# EasyEDA schematic 1-Schematic_今天的代码不Error.json
TITLE: Sheet_1; REV: 1.0; Date: 2022-07-03; Sheet: 1/1; Drawn By: Saitouhao; Company: Your Company
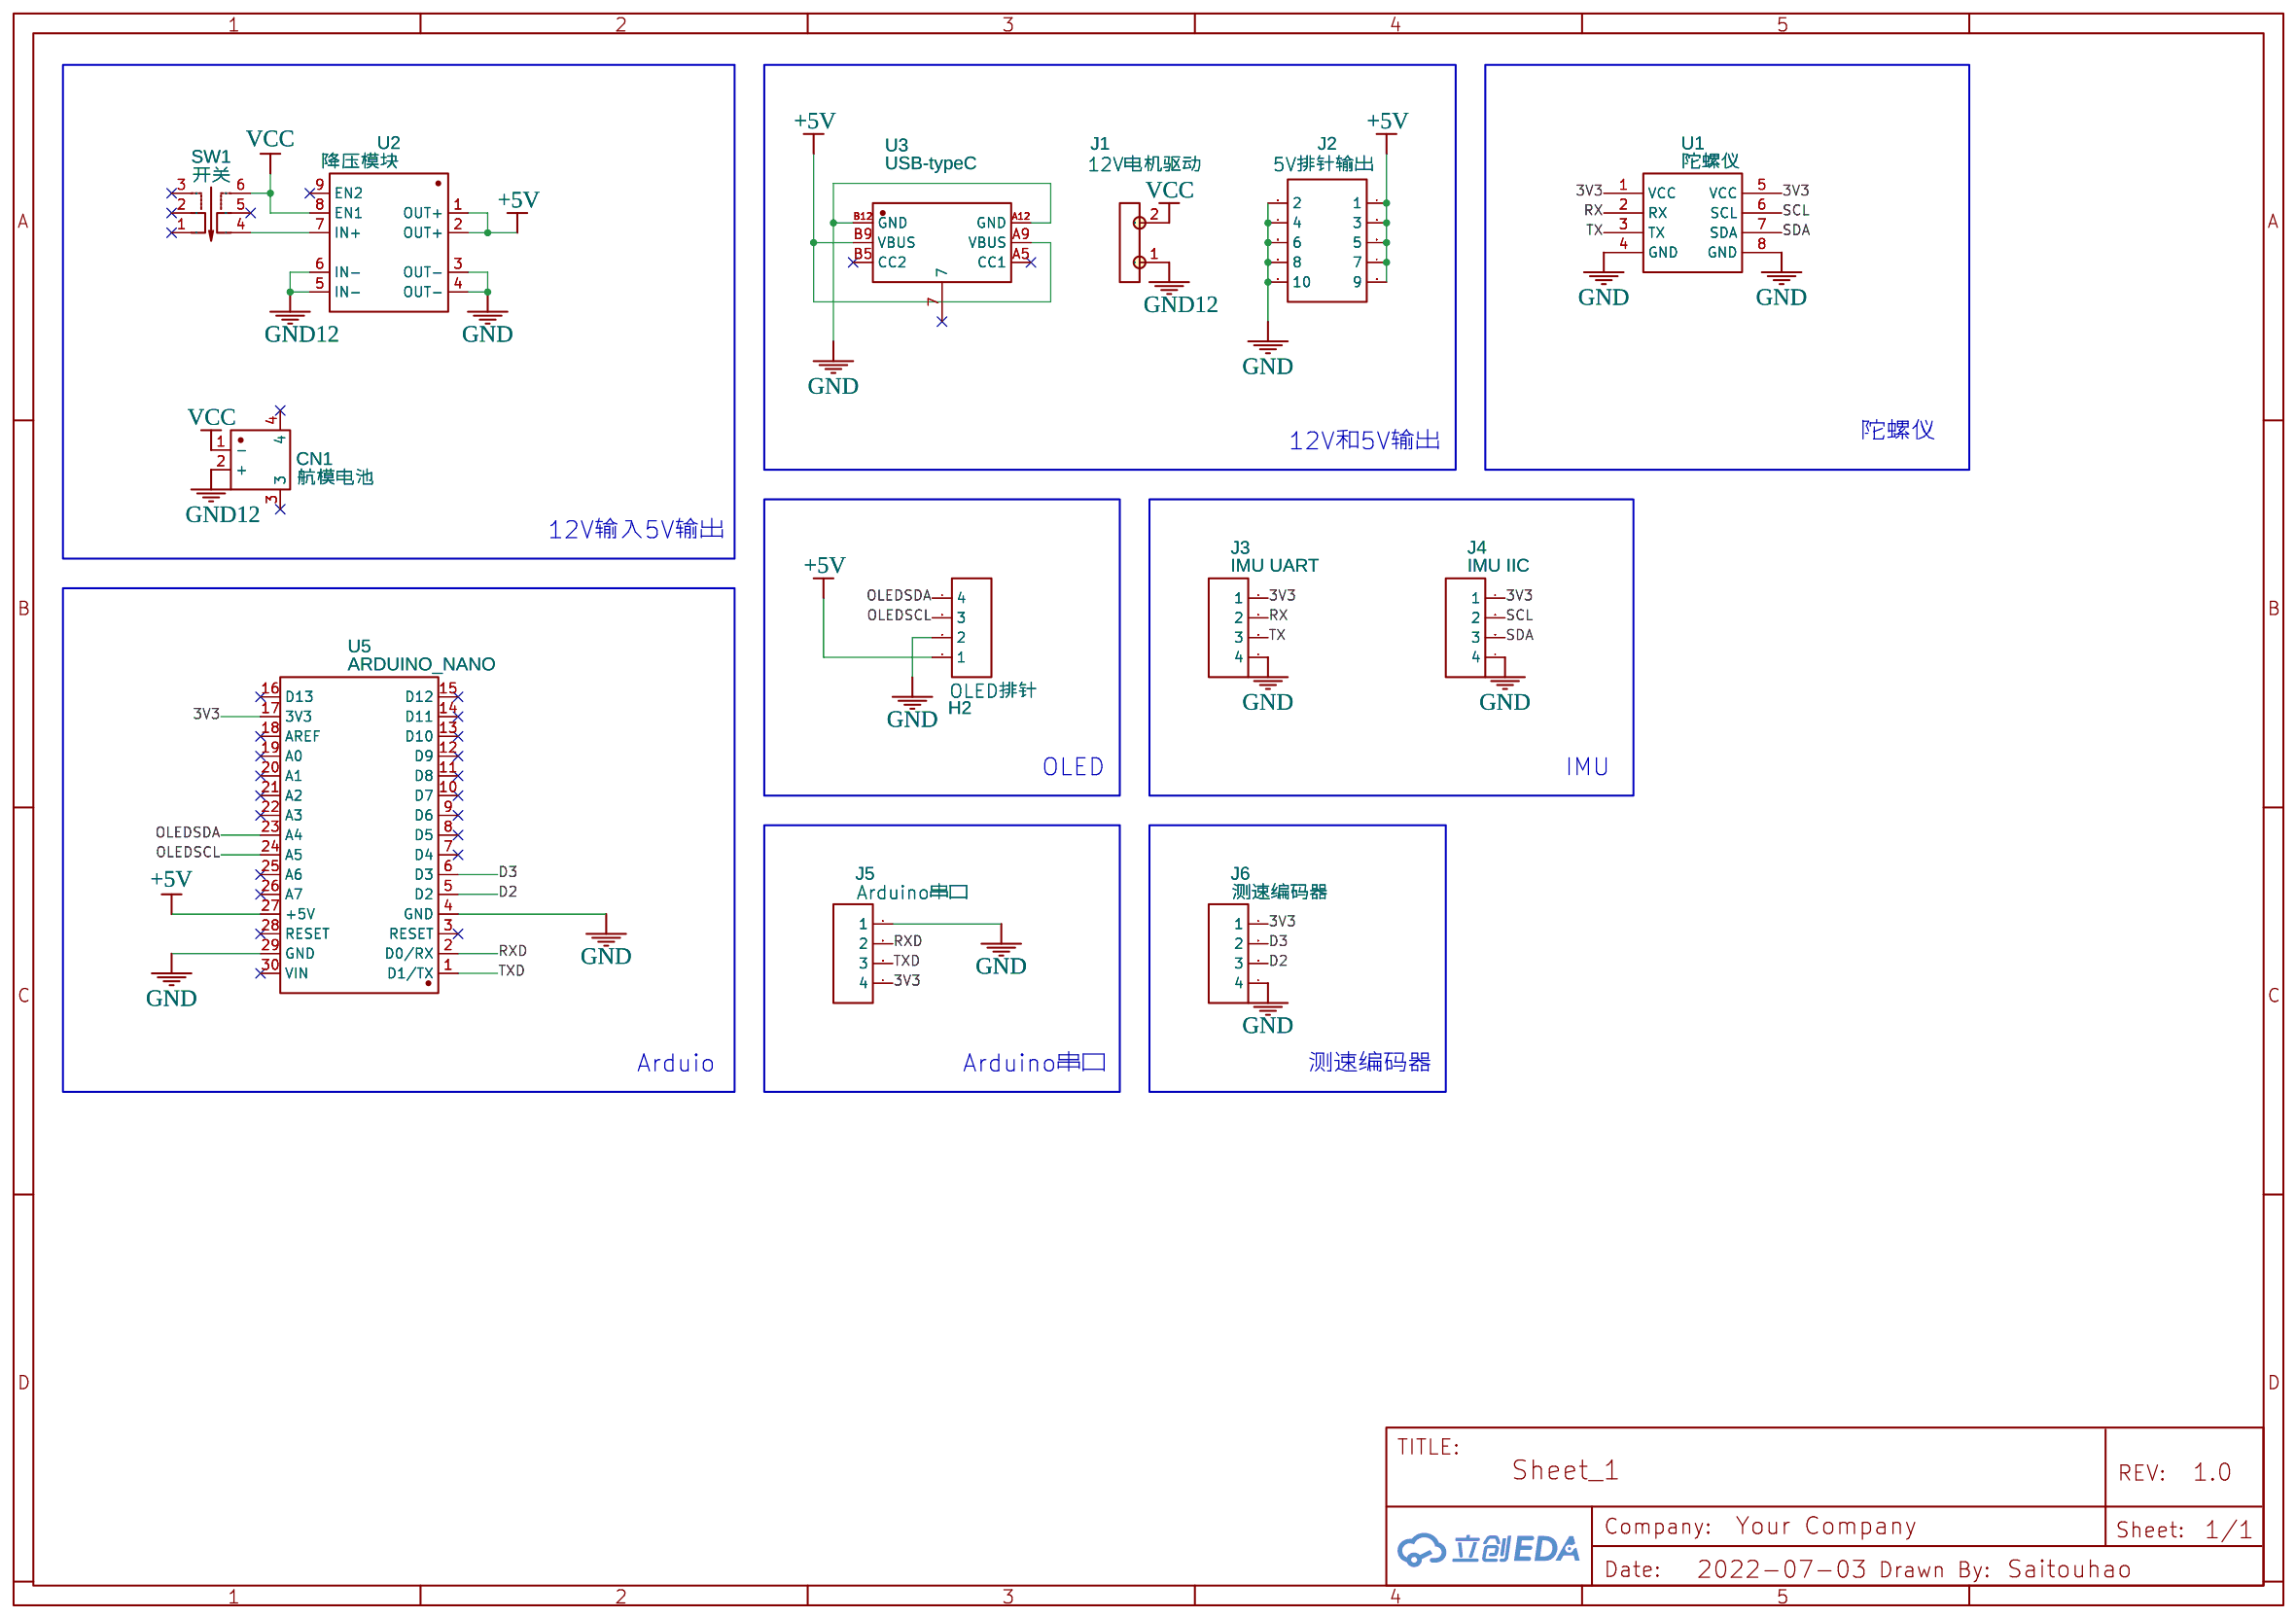
[diagram p0: schematic sheet]

## Parts
CN1  航模电池  [CONN-TH_XT60PW-M]
H2  OLED排针  [HDR-F-2.54_1X4]
J1  12V电机驱动  [CONN-TH_2P-P5.00-V-F_DB301R-5.0-2P]
J2  5V排针输出  [HDR-M-2.54_2X5]
J3  IMU UART  [HDR-M-2.54_1X4]
J4  IMU IIC  [HDR-M-2.54_1X4]
J5  Arduino串口  [HDR-M-2.54_1X4]
J6  测速编码器  [HDR-M-2.54_1X4]
SW1  开关  [SW-TH_6P-L5.8-W5.8-P2.00-LS4.5-BL]
U1  陀螺仪  [JY61-DIP8]
U2  降压模块  [XN-50L_SMD-9]
U3  USB-typeC  [TYPE-C-SMD_TYPE-C-6P-1]
U5  ARDUINO_NANO  [COMM-TH_ARDUINO_NANO]

## Library data of the parts
CN1 = XT60PW-M: Supplier: LCSC; Supplier Part: C98732; Manufacturer: AMASS(艾迈斯); JLCPCB Part Class: Extended Part; Contributor: LCSC
H2 = HDR-F-2.54_1x4: Supplier Part: C225501; Supplier: LCSC; Contributor: CUIT20190210800
J1 = CON1X02: Contributor: KiCad
J2 = HDR-M-2.54_2x5: Supplier Part: C178292; Supplier: LCSC; Contributor: chenjingxiong888
J3-J6 = HDR-M-2.54_1x4: Supplier Part: C124378; Supplier: LCSC; Contributor: 第13届蓝桥杯大赛学习团队
SW1 = PB22E60L: Supplier: LCSC; Supplier Part: C2987421; Manufacturer: CIKI(皓富); link: https://atta.szlcsc.com/upload/public/pdf/source/20220408/7804C2A84B830DBCF70465BF0AEFEFAC.pdf; Contributor: lcsc
U1 = JY61-DIP8: Contributor: wxyu999
U2 = XN-50L: Contributor: gongqianchao
U3 = USB-TYPE-C6P: Supplier: LCSC; Supplier Part: C9900001831; Manufacturer: null; JLCPCB Part Class: Extended Part; Contributor: LCSC
U5 = ARDUINO_NANO: Supplier: LCSC; Supplier Part: C9900017879; Manufacturer: null; JLCPCB Part Class: Extended Part; Contributor: lcsc

## Nets
3V3: J3.1 J4.1 J5.4 J6.1 U1.1(VCC) U1.5(VCC) U5.17(3V3)
+5V: H2.1 J2.1 J2.3 J2.5 J2.7 J2.9 U2.1(OUT+) U2.2(OUT+) U3.A9(VBUS) U3.B9(VBUS) U5.27(+5V)
GND: H2.2 J2.2 J2.4 J2.6 J2.8 J2.10 J3.4 J4.4 J5.1 J6.4 U1.4(GND) U1.8(GND) U2.3(OUT-) U2.4(OUT-) U3.A12(GND) U3.B12(GND) U5.4(GND) U5.29(GND)
GND12: CN1.2(+) J1.1 U2.5(IN-) U2.6(IN-)
VCC: CN1.1(-) J1.2 SW1.6 U2.8(EN1)
D2: J6.3 U5.5(D2)
D3: J6.2 U5.6(D3)
OLEDSCL: H2.3 U5.24(A5)
OLEDSDA: H2.4 U5.23(A4)
RX: J3.2 U1.2(RX)
RXD: J5.2 U5.2(D0/RX)
SCL: J4.2 U1.6(SCL)
SDA: J4.3 U1.7(SDA)
TX: J3.3 U1.3(TX)
TXD: J5.3 U5.1(D1/TX)
Net-(SW1-4): SW1.4 U2.7(IN+)

Not connected (* = marked no-connect by the designer): CN1 3* 4*; SW1 1* 2* 3* 5*; U2 9(EN2)*; U3 7* A5(CC1)* B5(CC2)*; U5 3(RESET)* 7(D4)* 8(D5)* 9(D6)* 10(D7)* 11(D8)* 12(D9)* 13(D10)* 14(D11)* 15(D12)* 16(D13)* 18(AREF)* 19(A0)* 20(A1)* 21(A2)* 22(A3)* 25(A6)* 26(A7)* 28(RESET)* 30(VIN)*

## Notes on the sheet
- 陀螺仪
- 12V和5V输出
- 12V输入5V输出
- OLED
- IMU
- Arduio
- Arduino串口
- 测速编码器
